# Altium schematic sheet Connector-side-1.SchDoc: =ProjectTitle
size 297 x 209 mm; Address1: Address1; Address2: Address2; Address3: Address3; Address4: Address4; SheetNumber: 4; SheetTotal: 7; Scale: 1:1; DocumentType: Схема электрическая принципиальная
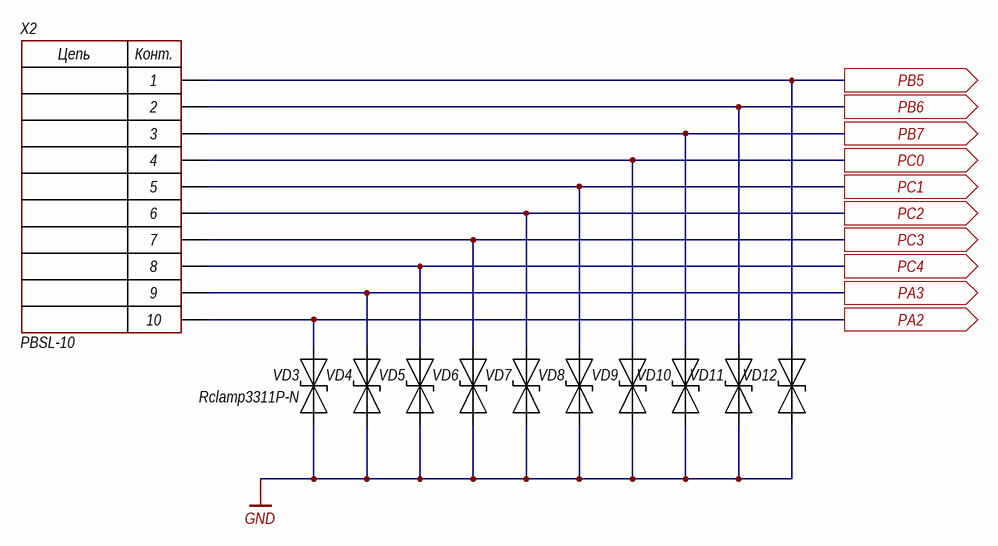
[diagram p0: Connector-side-1.SchDoc]

## Parts
VD3  Rclamp3311P-N  [DFN1006-2]
VD4  Rclamp3311P-N  [DFN1006-2]  (value not drawn)
VD5  Rclamp3311P-N  [DFN1006-2]  (value not drawn)
VD6  Rclamp3311P-N  [DFN1006-2]  (value not drawn)
VD7  Rclamp3311P-N  [DFN1006-2]  (value not drawn)
VD8  Rclamp3311P-N  [DFN1006-2]  (value not drawn)
VD9  Rclamp3311P-N  [DFN1006-2]  (value not drawn)
VD10  Rclamp3311P-N  [DFN1006-2]  (value not drawn)
VD11  Rclamp3311P-N  [DFN1006-2]  (value not drawn)
VD12  Rclamp3311P-N  [DFN1006-2]  (value not drawn)
X2  PBSL-10  [CON: PBSL-10]

## Ports
PA2 (out), PA3 (out), PB5 (out), PB6 (out), PB7 (out), PC0 (out), PC1 (out), PC2 (out), PC3 (out), PC4 (out)

## Nets
GND: VD3.1(A) VD4.1(A) VD5.1(A) VD6.1(A) VD7.1(A) VD8.1(A) VD9.1(A) VD10.1(A) VD11.1(A) VD12.1(A)
PA2: VD3.2(C) X2.10 ; port PA2
PA3: VD4.2(C) X2.9 ; port PA3
PB5: VD12.2(C) X2.1 ; port PB5
PB6: VD11.2(C) X2.2 ; port PB6
PB7: VD10.2(C) X2.3 ; port PB7
PC0: VD9.2(C) X2.4 ; port PC0
PC1: VD8.2(C) X2.5 ; port PC1
PC2: VD7.2(C) X2.6 ; port PC2
PC3: VD6.2(C) X2.7 ; port PC3
PC4: VD5.2(C) X2.8 ; port PC4

## Notes on the sheet
- Изм.
- Лист
- № докум.
- Подп.
- Дата
- Копировал
- Формат А4
- (in symbol 10-Connector) Цепь; Конт.

## Library data of the parts
VD3-VD12 = TVS-diod: Manufacturer: BORN; ComponentKind: 3.3V, 8V. 10A; Model: Rclamp3311P-N; HelpURL: https://www.lcsc.com/product-detail/ESD-Protection-Devices_BORN-Rclamp3311P-N_C406234.html
X2 = 10-Connector: Model: PBSL-10; Manufacturer: *; HelpURL: *; ComponentKind: *